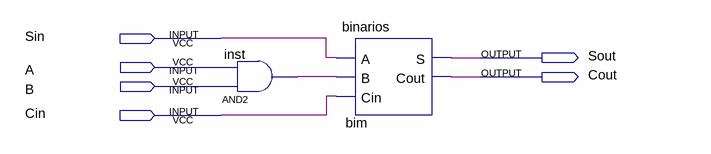
[diagram p0: schematic sheet]
// Quartus schematic projeto_multiplicador.bdf as structural Verilog: 2 symbols, 6 pins
module projeto_multiplicador (
  input  Sin,
  input  A,
  input  B,
  input  Cin,
  output Sout,
  output Cout
);

  wire inst_out;

  and inst (inst_out, B, A);
  binarios bim (.A(Sin), .B(inst_out), .Cin(Cin), .S(Sout), .Cout(Cout));
endmodule
